# Altium project Unit.PrjPCB
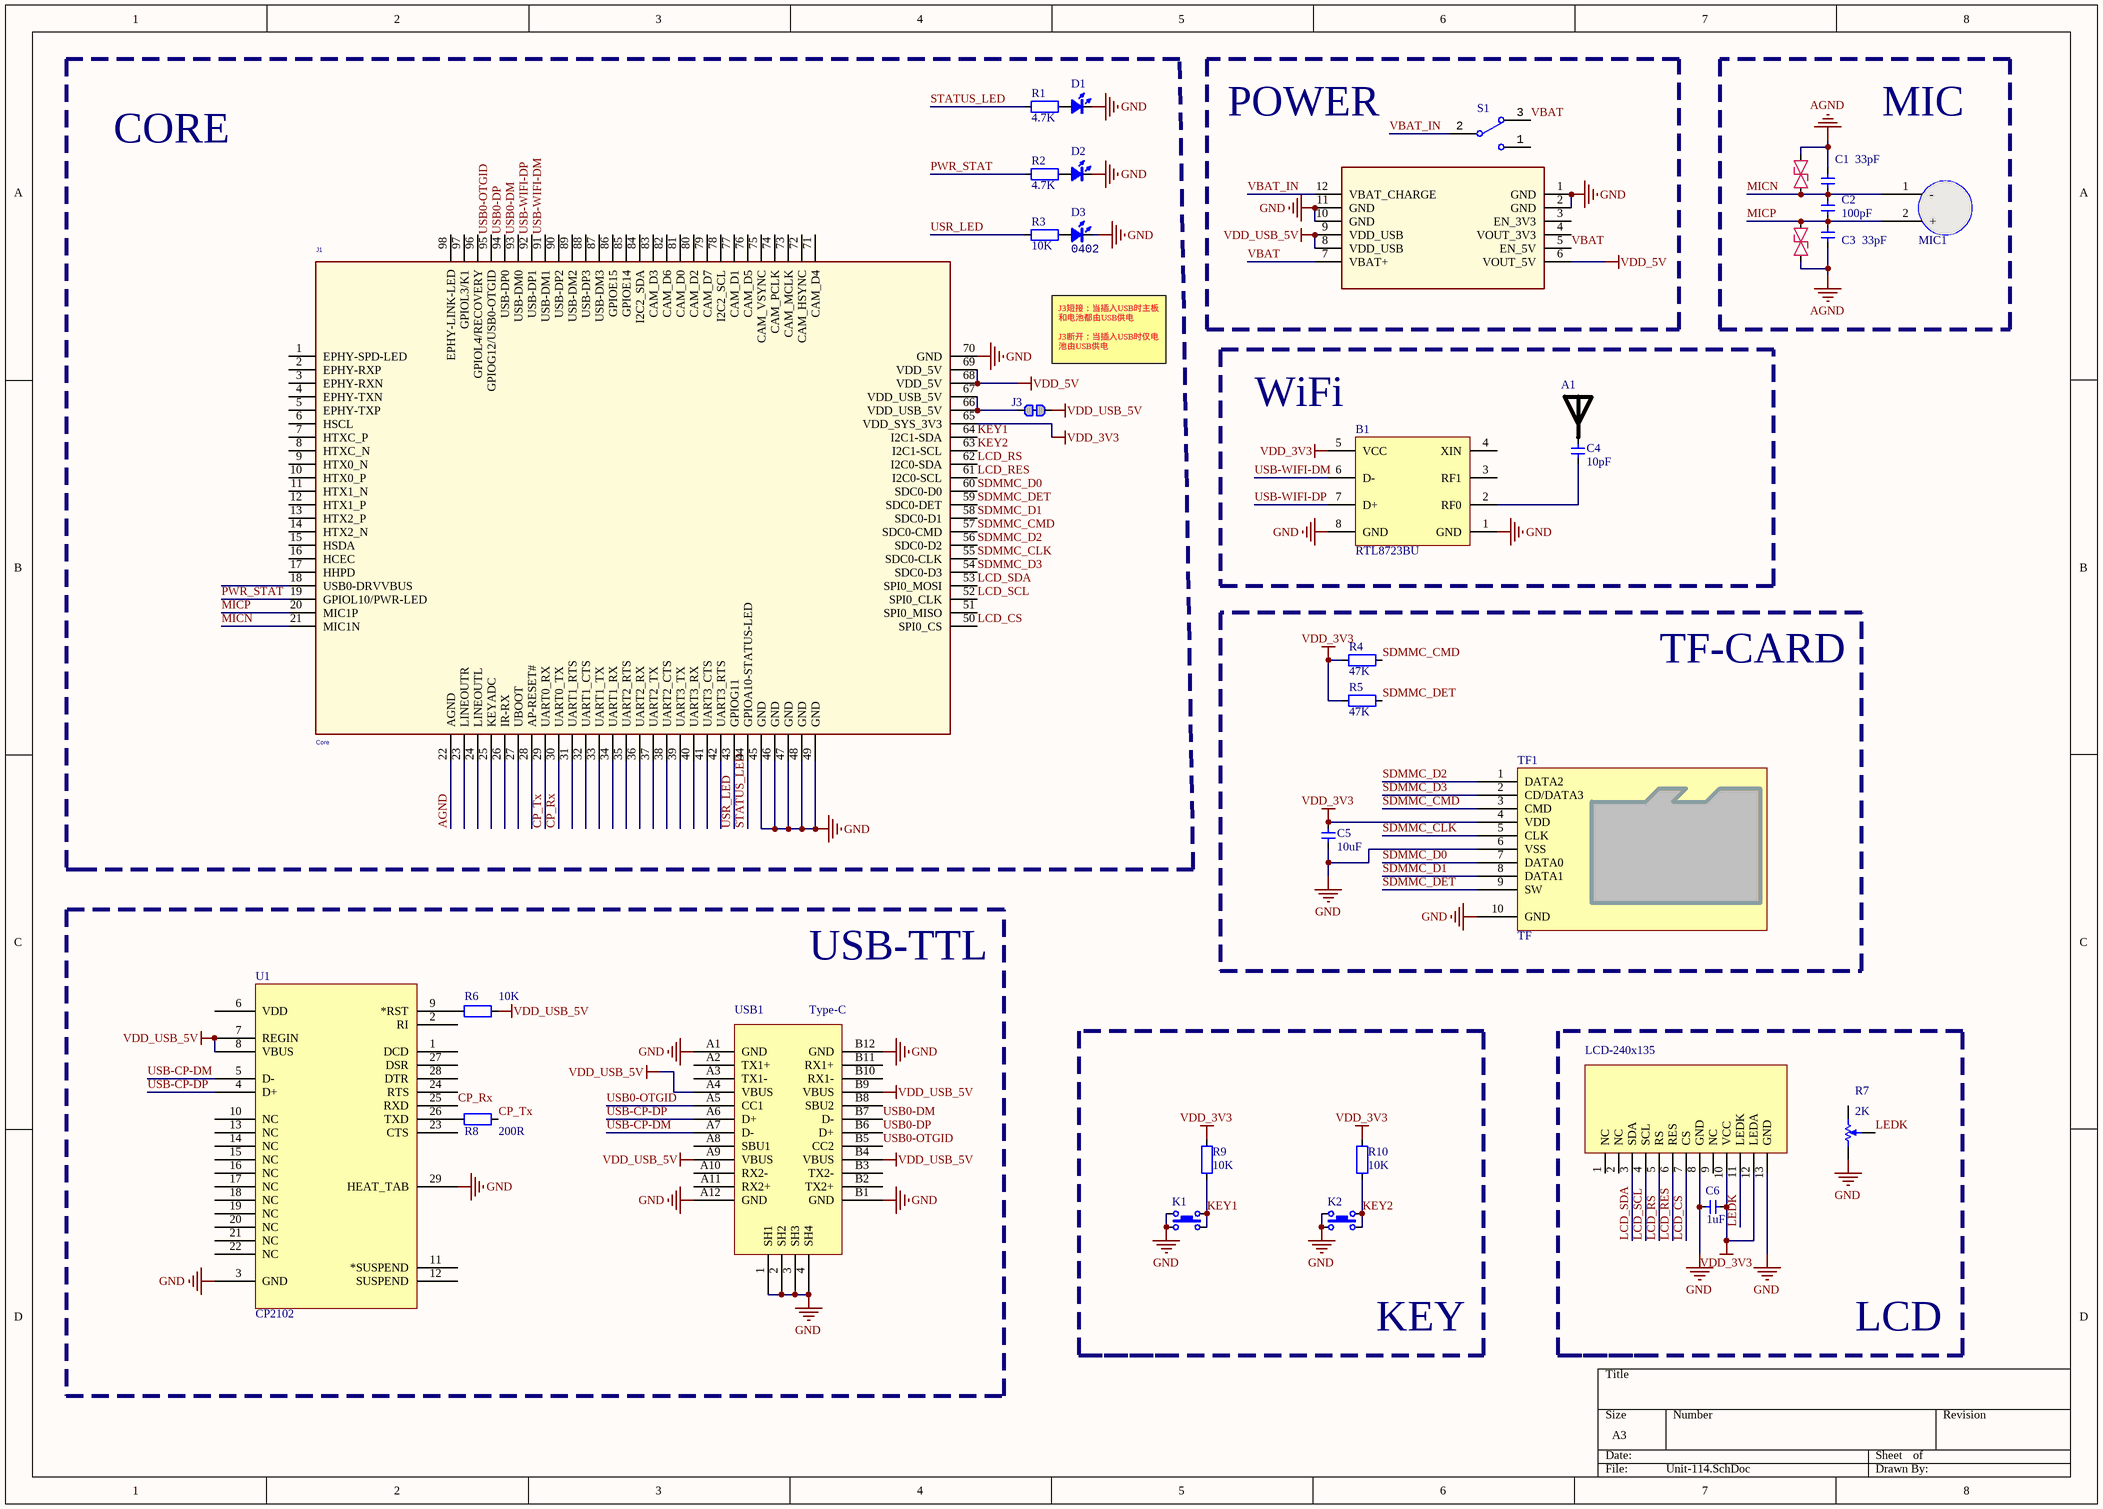
[diagram p0: Unit-114.SchDoc]
1 sheet, 34 parts. Net scope: global (net labels, ports and power ports of the same name join across sheets).
Board file: Unit-114.PcbDoc

## Sheet Unit-114.SchDoc
size A3

### Parts
1  LCD-240x135  [LCD-240x135]
A1  RAINSUN  [ANT-Rainsun-AN5120]  (value not drawn)
B1  RTL8723BU  [USB-WiFI-BT-RTL8723BU]
C1  33pF  [CAP_0402]
C2  100pF  [CAP_0402]
C3  33pF  [CAP_0402]
C4  10pF  [CAP_0402]
C5  10uF  [CAP_0402]
C6  1uF  [CAP_0402]
D1  color?  [LED_0402_RED]  (value not drawn)
D2  color?  [LED_0402_YELLOW]  (value not drawn)
D3  Type: 0402  [LED_0402_BLUE]  (hidden comment: color?)
ESD-1  ESD-0402  [ESD-0402]  (value not drawn)
ESD-2  ESD-0402  [ESD-0402]  (value not drawn)
J1  Core  [Quantum-Quark]
J2  Power  [Quantum-GLUON]  (value not drawn)
J3  跳线  [0402-0R]  (value not drawn)
K1  TACT 4P  [ButtonTACT_3.5*3.55_90]  (value not drawn)
K2  TACT 4P  [ButtonTACT_3.5*3.55_90]  (value not drawn)
MIC1  MIC*  [MIC-SMT]  (value not drawn)
R1  4.7K  [RES_0402]
R2  4.7K  [RES_0402]
R3  10K  [RES_0402]
R4  47K  [RES_0402]
R5  47K  [RES_0402]
R6  10K  [RES_0402]
R7  2K  [贴片电位器 3*3]
R8  200R  [RES_0402]
R9  10K  [RES_0402]
R10  10K  [RES_0402]
S1  SPDT 3P  [SwitchSPDT_2.8X6.6_90]  (value not drawn)
TF1  TF  [TF-SOCKET - short]
U1  CP2102  [QFN-28]
USB1  Type-C  [Type-C-TOP]

### Blocks framed on the sheet
CORE: D1-D3 J1 J3 R1-R3
POWER: J2 S1
TF-CARD: C5 R4 R5 TF1

### Nets
AGND: C1.1 C3.1 ESD-1.2 ESD-2.1 J1.22(AGND)
GND: 1.8(GND) 1.13(GND) B1.1(GND) B1.8(GND) C5.1 C6.2 D1.2(K) D2.2(K) D3.2(K) J1.45(GND) J1.46(GND) J1.47(GND) J1.48(GND) J1.49(GND) J1.70(GND) J2.1(GND) J2.2(GND) J2.10(GND) J2.11(GND) K1.1 K1.3 K2.1 K2.3 R7.2(-) TF1.6(VSS) TF1.10(GND) U1.3(GND) U1.29(HEAT_TAB) USB1.1(SH1) USB1.2(SH2) USB1.3(SH3) USB1.4(SH4) USB1.A1(GND) USB1.A12(GND) USB1.B1(GND) USB1.B12(GND)
VDD_3V3: 1.10(VCC) 1.12(LEDA) B1.5(VCC) C5.2 C6.1 J1.65(VDD_SYS_3V3) R4.1 R5.1 R9.2 R10.2 TF1.4(VDD)
VDD_5V: J1.68(VDD_5V) J1.69(VDD_5V) J2.6(VOUT_5V)
VDD_USB_5V: J2.8(VDD_USB) J2.9(VDD_USB) J3.2 R6.1 U1.7(REGIN) U1.8(VBUS) USB1.A4(VBUS) USB1.A9(VBUS) USB1.B4(VBUS) USB1.B9(VBUS)
CP_Rx: J1.30(UART0_TX) U1.25(RXD)
CP_Tx: J1.29(UART0_RX) R8.1
KEY1: J1.64(I2C1-SDA) K1.2 K1.4 R9.1
KEY2: J1.63(I2C1-SCL) K2.2 K2.4 R10.1
LCD_CS: 1.7(CS) J1.50(SPI0_CS)
LCD_RES: 1.6(RES) J1.61(I2C0-SCL)
LCD_RS: 1.5(RS) J1.62(I2C0-SDA)
LCD_SCL: 1.4(SCL) J1.52(SPI0_CLK)
LCD_SDA: 1.3(SDA) J1.53(SPI0_MOSI)
LEDK: 1.11(LEDK) R7.3(W)
MICN: C1.2 C2.2 ESD-1.1 J1.21(MIC1N) MIC1.1(-)
MICP: C2.1 C3.2 ESD-2.2 J1.20(MIC1P) MIC1.2(+)
PWR_STAT: J1.19(GPIOL10/PWR-LED) R2.1
SDMMC_CLK: J1.55(SDC0-CLK) TF1.5(CLK)
SDMMC_CMD: J1.57(SDC0-CMD) R4.2 TF1.3(CMD)
SDMMC_D0: J1.60(SDC0-D0) TF1.7(DATA0)
SDMMC_D1: J1.58(SDC0-D1) TF1.8(DATA1)
SDMMC_D2: J1.56(SDC0-D2) TF1.1(DATA2)
SDMMC_D3: J1.54(SDC0-D3) TF1.2(CD/DATA3)
SDMMC_DET: J1.59(SDC0-DET) R5.2 TF1.9(SW)
STATUS_LED: J1.44(GPIOA10-STATUS-LED) R1.1
USB0-DM: J1.93(USB-DM0) USB1.B7(D-)
USB0-DP: J1.94(USB-DP0) USB1.B6(D+)
USB0-OTGID: J1.95(GPIOG12/USB0-OTGID) USB1.A5(CC1) USB1.B5(CC2)
USB-CP-DM: U1.5(D-) USB1.A7(D-)
USB-CP-DP: U1.4(D+) USB1.A6(D+)
USB-WIFI-DM: B1.6(D-) J1.91(USB-DM1)
USB-WIFI-DP: B1.7(D+) J1.92(USB-DP1)
USR_LED: J1.43(GPIOG11) R3.1
VBAT: J2.5(EN_5V) J2.7(VBAT+) S1.3
VBAT_IN: J2.12(VBAT_CHARGE) S1.2
NetA1_1: A1.1 C4.1
NetB1_2: B1.2(RF0) C4.2
NetD1_1: D1.1(A) R1.2
NetD2_1: D2.1(A) R2.2
NetD3_1: D3.1(A) R3.2
NetJ1_66: J1.66(VDD_USB_5V) J1.67(VDD_USB_5V) J3.1
NetR6_2: R6.2 U1.9(*RST)
NetR8_2: R8.2 U1.26(TXD)

Not connected (* = marked no-connect by the designer): 1 1(NC) 2(NC) 9(NC); B1 3(RF1) 4(XIN); J1 1(EPHY-SPD-LED) 2(EPHY-RXP) 3(EPHY-RXN) 4(EPHY-TXN) 5(EPHY-TXP) 6(HSCL) 7(HTXC_P) 8(HTXC_N) 9(HTX0_N) 10(HTX0_P) 11(HTX1_N) 12(HTX1_P) 13(HTX2_P) 14(HTX2_N) 15(HSDA) 16(HCEC) 17(HHPD) 18(USB0-DRVVBUS) 23(LINEOUTR) 24(LINEOUTL) 25(KEYADC) 26(IR-RX) 27(UBOOT) 28(AP-RESET#) 31(UART1_RTS) 32(UART1_CTS) 33(UART1_TX) 34(UART1_RX) 35(UART2_RTS) 36(UART2_RX) 37(UART2_TX) 38(UART2_CTS) 39(UART3_TX) 40(UART3_RX) 41(UART3_CTS) 42(UART3_RTS) 51(SPI0_MISO) 71(CAM_D4) 72(CAM_HSYNC) 73(CAM_MCLK) 74(CAM_PCLK) 75(CAM_VSYNC) 76(CAM_D5) 77(CAM_D1) 78(I2C2_SCL) 79(CAM_D7) 80(CAM_D2) 81(CAM_D0) 82(CAM_D6) 83(CAM_D3) 84(I2C2_SDA) 85(GPIOE14) 86(GPIOE15) 87(USB-DM3) 88(USB-DP3) 89(USB-DM2) 90(USB-DP2) 96(GPIOL4/RECOVERY) 97(GPIOL3/K1) 98(EPHY-LINK-LED); J2 3(EN_3V3) 4(VOUT_3V3); R7 1(+); S1 1; U1 1(DCD) 2(RI) 6(VDD) 10(NC) 11(*SUSPEND) 12(SUSPEND) 13(NC) 14(NC) 15(NC) 16(NC) 17(NC) 18(NC) 19(NC) 20(NC) 21(NC) 22(NC) 23(CTS) 24(RTS) 27(DSR) 28(DTR); USB1 A2(TX1+) A3(TX1-) A8(SBU1) A10(RX2-) A11(RX2+) B2(TX2+) B3(TX2-) B8(SBU2) B10(RX1-) B11(RX1+)

### Notes on the sheet
- MIC
- J3短接：当插入USB时主板和电池都由USB供电
  J3断开：当插入USB时仅电池由USB供电
- (near B1) WiFi
- USB-TTL
- KEY
- LCD

### Library data of the parts
1 = LCD-240x135: 显示屏
A1 = ANT-Rainsun-AP5120
B1 = USB-WiFi-BT-RTL8723BU
C1-C6 = 电容-0402: Capacitor; Value: 0.1u
D1 D2 = LED_0402: LED; Type: 0402; Value: color?
D3 = LED_0402: LED; Value: color?
ESD-1 ESD-2 = ESD-0402: ESD
J1 = Quantum-Quark-Core
J2 = Quantum-Gluon-Power
J3 = 跳线: Resistor; Published: 8-Jun-2000; LatestRevisionDate: 17-Jul-2002; LatestRevisionNote: Re-released for DXP Platform.; PackageReference: AXIAL-0.4; Publisher: Altium Limited; PackageDescription: Axial Device, Thru-Hole; 2 Leads; 0.4 in Pin Spacing
K1 K2 = ButtonTACT: Button; value: 3.4x3.5; type: TACT 4P
MIC1 = MIC
R1-R6 R8-R10 = 电阻-0402: Resistor; Value: 22R
R7 = 电位器-贴片: Published: 17-Dec-2003; DatasheetVersion: Oct-2003; PackageReference: POT4MM-2; Publisher: Altium Limited; PackageDescription: Square Trimming Potentiometer; ComponentLink1Description: Manufacturer Link; ComponentLink1URL: http://bourns.com/2/search.html
S1 = SwitchSPDT_2.8x6.6_90: Switch; Value: SPDT 3P; Type: SPDT
TF1 = TF卡座: 8脚自弹
U1 = CP2102: USB转TTL; PART DESC: SINGLE-CHIP USB TO UART BRIDGE, QFN28, RoHS.; MFG #1: SILICON LABS; PART NUMBER: CP2102; Value: Value; RefDes: RefDes; Type: DEV
USB1 = USB-Type-C-TOP